# EAGLE design powerdistboard (EAGLE 5.10)
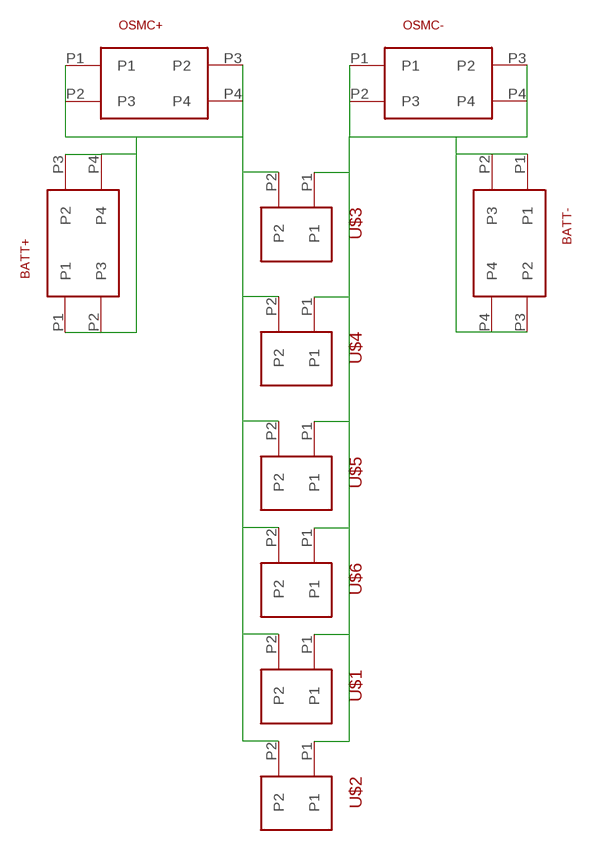
[diagram p0: schematic, sheet 1]

## Parts
BATT+  2W2HRA  [2W2HRA]
BATT-  2W2HRA  [2W2HRA]
OSMC+  2W2HRA  [2W2HRA]
OSMC-  2W2HRA  [2W2HRA]
U$1  2W1HS  [2W1HS]
U$2  2W1HS  [2W1HS]
U$3  2W1HS  [2W1HS]
U$4  2W1HS  [2W1HS]
U$5  2W1HS  [2W1HS]
U$6  2W1HS  [2W1HS]

## Nets
+24: BATT+.P1 BATT+.P2(P3) BATT+.P3(P2) BATT+.P4 OSMC+.P1 OSMC+.P2(P3) OSMC+.P3(P2) OSMC+.P4 U$1.P2 U$2.P2 U$3.P2 U$4.P2 U$5.P2 U$6.P2
GND: BATT-.P1 BATT-.P2(P3) BATT-.P3(P2) BATT-.P4 OSMC-.P1 OSMC-.P2(P3) OSMC-.P3(P2) OSMC-.P4 U$1.P1 U$2.P1 U$3.P1 U$4.P1 U$5.P1 U$6.P1

## Library data of the parts
BATT+ BATT- OSMC+ OSMC- = anderson15:2W2HRA
U$1-U$6 = anderson15:2W1HS

## Board
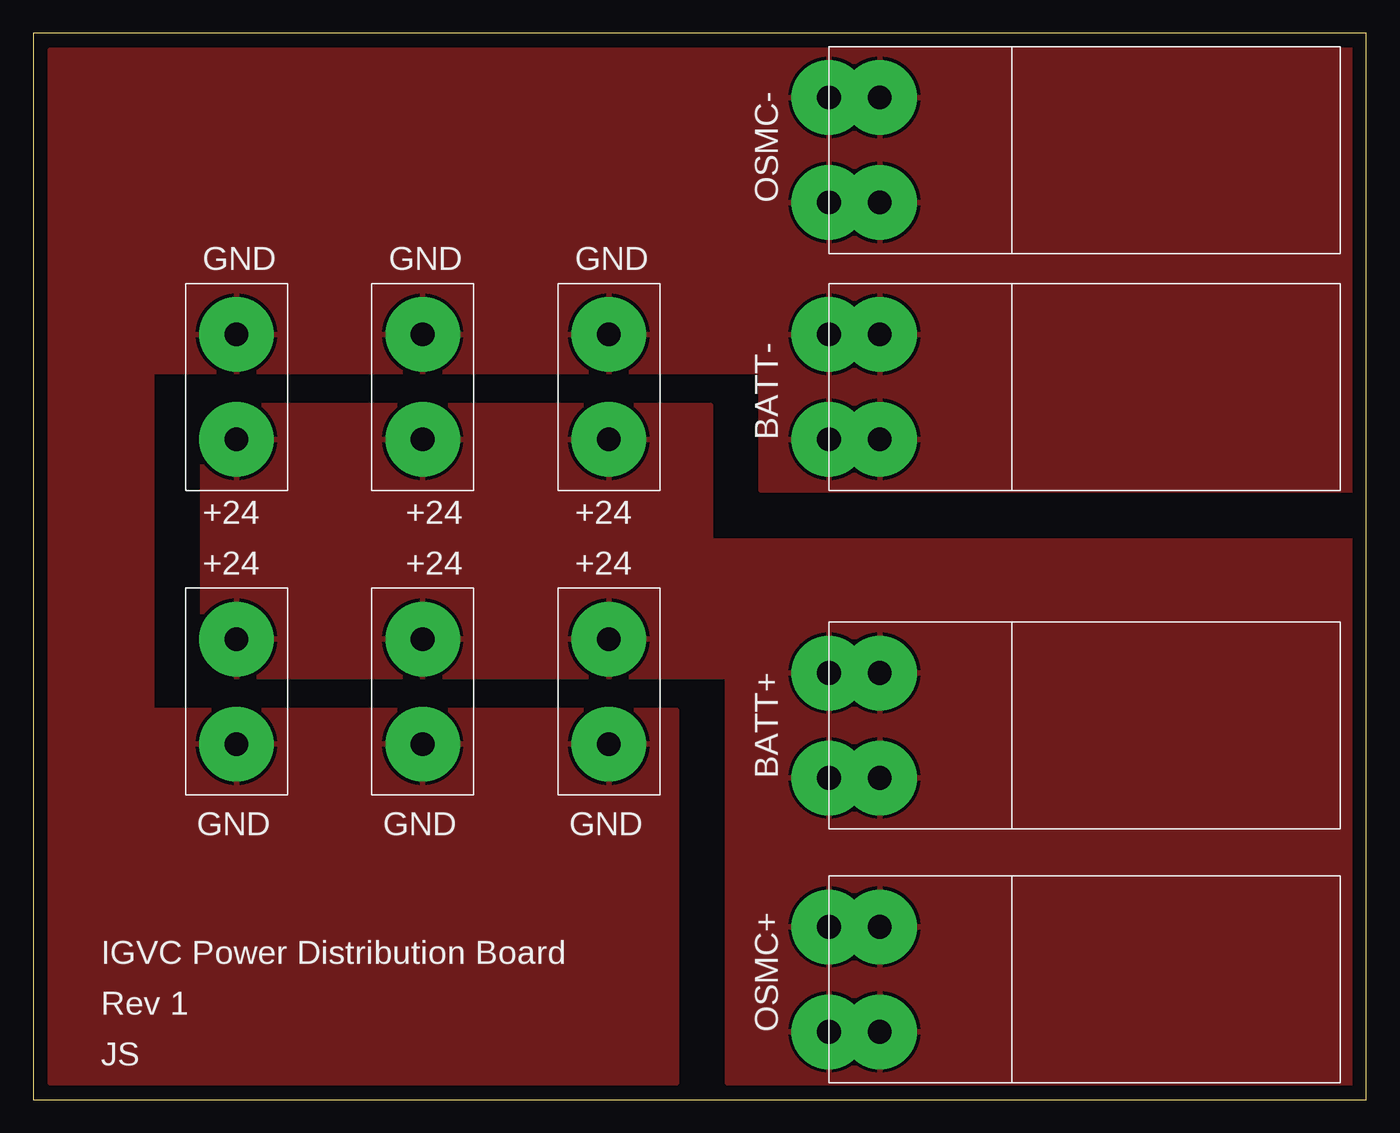
[diagram p1: board, top side]
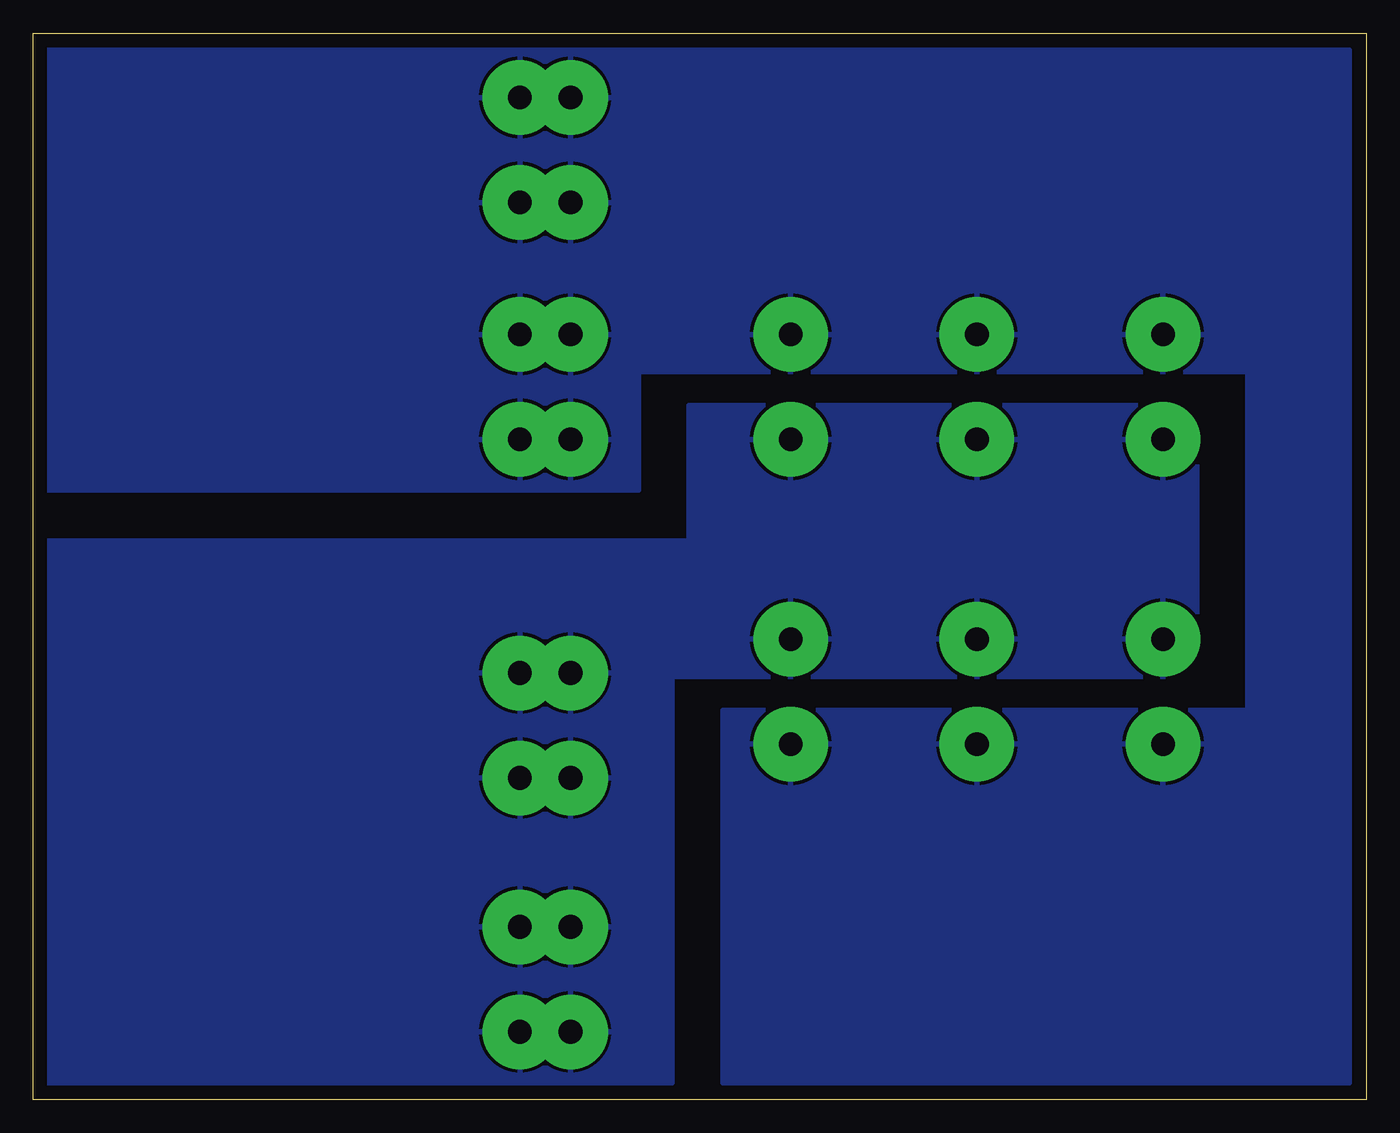
[diagram p2: board, bottom side, seen from below]

Size 100 x 80 mm. Coordinates in mm from the lower left corner, seen from the top.
Outline: 0,0 100,0 100,80 0,80 0,0
Copper layers (1*16): Top 0.035mm / dielectric 1.5mm / Bottom 0.035mm
Design rules "default": minimum track width 10mil, minimum drill 24mil, track to track 8mil, track to pad 8mil, pad to pad 8mil, via to via 8mil, smd to smd 8mil, copper to edge 40mil, drill to drill 8mil, minimum pad ring 10mil, minimum via ring 8mil, stop-mask expansion 4mil, vias tented up to drill 0mil, thermal gap 10mil

### Footprints (pad centres in the part's own frame; a part is rotated, then mirrored left to right if it is on the bottom)
2W2HRA = drill 1.778 pad 5.588 round: P1 0,7.874; P2 3.81,7.874; P3 0,0; P4 3.81,0
2W1HS = drill 1.778 pad 5.588 round: P1 0,0; P2 7.874,0

### Placement (x,y rotation side)
BATT+  59.69,24.13 0 top
BATT-  59.69,49.53 0 top
OSMC+  59.69,5.08 0 top
OSMC-  59.69,67.31 0 top
U$1  15.24,57.4 270 top
U$2  29.21,26.67 90 top
U$3  43.18,26.67 90 top
U$4  15.24,26.67 90 top
U$5  29.21,57.4 270 top
U$6  43.18,57.4 270 top

### Tracks (layer width: path | path; a pad name or v marks a point on that pad's centre or on a via)
+24
  pour Top: 50.8,41.91 99.06,41.91 99.06,1.27 52.07,1.27 52.07,31.75 12.7,31.75 12.7,52.07 50.8,52.07
  pour Bottom: 12.7,52.07 12.7,31.75 52.07,31.75 52.07,1.27 99.06,1.27 99.06,41.91 50.8,41.91 50.8,52.07
GND
  pour Top: 99.06,45.72 99.06,78.74 1.27,78.74 1.27,1.27 48.26,1.27 48.26,29.21 8.89,29.21 8.89,54.61 54.61,54.61 54.61,45.72
  pour Bottom: 54.61,45.72 99.06,45.72 99.06,78.74 1.27,78.74 1.27,1.27 48.26,1.27 48.26,29.21 8.89,29.21 8.89,54.61 54.61,54.61

### Text on the board
tNames: OSMC- | GND | GND | GND | BATT- | +24 | +24 | +24 | +24 | +24 | +24 | BATT+ | GND | GND | GND | IGVC Power Distribution Board | Rev 1 | OSMC+ | JS